# Altium schematic sheet Sheet1.SchDoc: Контроллер нетривиального станка с ЧПУ
size 420 x 297 mm; Date: 22.11.23; Author: Барков; CompanyName: BarCockSemenConductor; DrawnBy: Барков; Engineer: БАРКОВ; Organization: BarCockSemenConductor; DocumentNumber: хххххххх; Revision: 1; SheetNumber: 1; SheetTotal: 5
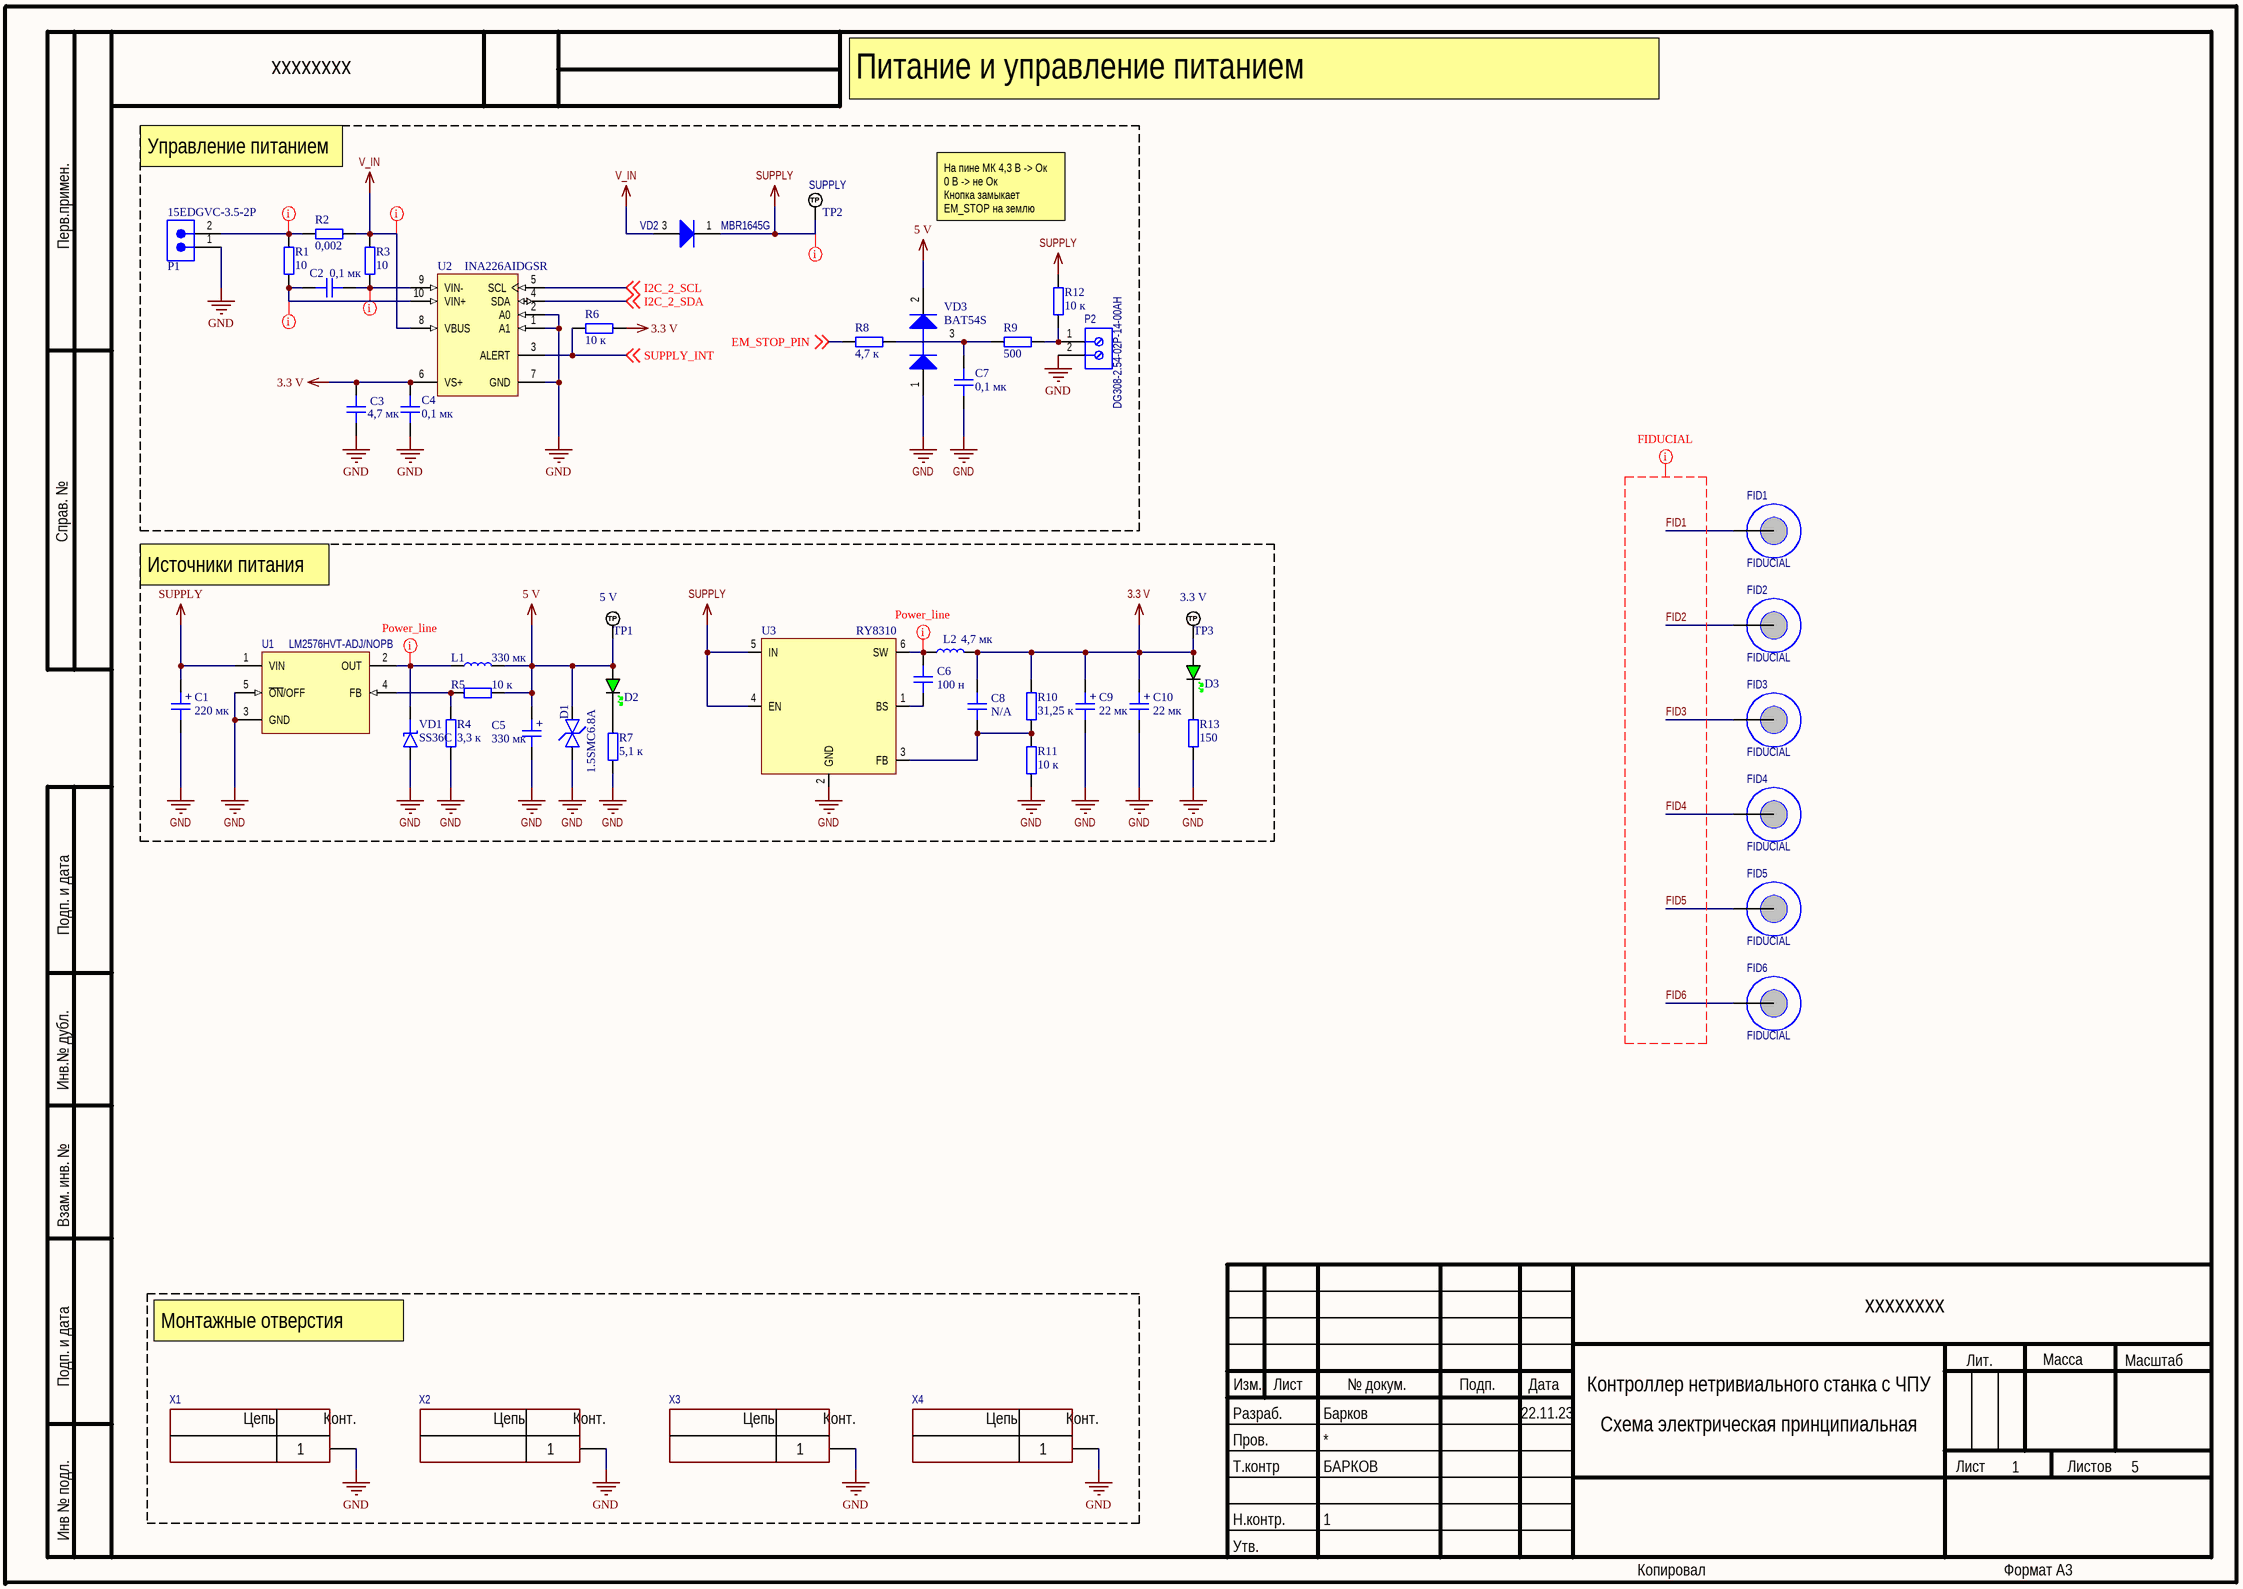
[diagram p0: Sheet1.SchDoc]

## Parts
C1  220 мк  [D10C5H12.5]
C2  0,1 мк  [CAP_0603]
C3  4,7 мк  [CAP_0805]
C4  0,1 мк  [CAP_0603]
C5  330 мк  [D8C3.5H12]
C6  100 н  [CAP_0603]
C7  0,1 мк  [CAP_0603]
C8  N/A  [CAP_0603]
C9  22 мк  [TANTAL_B]
C10  22 мк  [TANTAL_B]
D1  1.5SMC6.8A  [SMC-DO-214AB]
D2  GREEN  [LED_0603_GREEN]  (value not drawn)
D3  GREEN  [LED_0603_GREEN]  (value not drawn)
FID1  FIDUCIAL  [FIDUCIAL]
FID2  FIDUCIAL  [FIDUCIAL]
FID3  FIDUCIAL  [FIDUCIAL]
FID4  FIDUCIAL  [FIDUCIAL]
FID5  FIDUCIAL  [FIDUCIAL]
FID6  FIDUCIAL  [FIDUCIAL]
L1  330 мк  [IND: B82477G4]
L2  4,7 мк  [NRS5020]
P1  15EDGVC-3.5-2P  [691321100002]
P2  DG308-2.54-02P-14-00AH  [PHOE-1725656-2]
R1  10  [RES_0603]
R2  0,002  [ch2512r]
R3  10  [RES_0603]
R4  3,3 к  [RES_0603]
R5  10 к  [RES_0603]
R6  10 к  [RES_0603]
R7  5,1 к  [RES_0603]
R8  4,7 к  [RES_0603]
R9  500  [RES_0603]
R10  31,25 к  [RES_0603]
R11  10 к  [RES_0603]
R12  10 к  [RES_0603]
R13  150  [RES_0603]
TP1  5 V  [PAD_RND_1MM]  (no BOM)
TP2  SUPPLY  [PAD_RND_1MM]  (no BOM)
TP3  3.3 V  [PAD_RND_1MM]  (no BOM)
U1  LM2576HVT-ADJ/NOPB  [KC0005A]
U2  INA226AIDGSR  [DGS0010A_L]
U3  RY8310  [SOT-23-6]
VD1  SS36C  [SMC-DO-214AB]
VD2  MBR1645G  [ONSC-TO-220-2-221B-04_E]
VD3  BAT54S  [ONSC-SOT-323-3-419-04_V]
X1  *  [CON: PADS 1x3mm]  (value not drawn)  (no BOM)
X2  *  [CON: PADS 1x3mm]  (value not drawn)  (no BOM)
X3  *  [CON: PADS 1x3mm]  (value not drawn)  (no BOM)
X4  *  [CON: PADS 1x3mm]  (value not drawn)  (no BOM)

## Nets
3.3 V: C3.2 C4.1 C8.2 C9.1 C10.1 D3.A L2.2 R6.2 R10.1 TP3.1(TP) U2.6(VS+)
5 V: C5.1 D1.K D2.A L1.2 R5.1 TP1.1(TP) VD3.2(K)
GND: C1.2 C3.1 C4.2 C5.2 C7.2 C9.2 C10.2 D1.A P1.1 P2.2 R4.1 R7.1 R11.2 R13.1 U1.3(GND) U1.5(~{ON}/OFF) U2.1(A1) U2.2(A0) U2.7(GND) U3.2(GND) VD1.A VD3.1(A) X1.1 X2.1 X3.1 X4.1
SUPPLY: C1.1 R12.2 TP2.1(TP) U1.1(VIN) U3.4(EN) U3.5(IN) VD2.1(K)
V_IN: R2.2 R3.1 U2.8(VBUS) VD2.3(A)
EM_STOP_PIN: R8.2 ; off-sheet EM_STOP_PIN
FID1: FID1.1
FID2: FID2.1
FID3: FID3.1
FID4: FID4.1
FID5: FID5.1
FID6: FID6.1
I2C_2_SCL: U2.5(SCL) ; off-sheet I2C_2_SCL
I2C_2_SDA: U2.4(SDA) ; off-sheet I2C_2_SDA
SUPPLY_INT: R6.1 U2.3(ALERT) ; off-sheet SUPPLY_INT
NetC2_1: C2.1 R3.2 U2.9(VIN-)
NetC2_2: C2.2 R1.2 U2.10(VIN+)
NetC6_1: C6.1 U3.1(BS)
NetC6_2: C6.2 L2.1 U3.6(SW)
NetC7_1: C7.1 R8.1 R9.2 VD3.3(K/A)
NetC8_1: C8.1 R10.2 R11.1 U3.3(FB)
NetD2_K: D2.K R7.2
NetD3_K: D3.K R13.2
NetL1_1: L1.1 U1.2(OUT) VD1.K
NetP1_2: P1.2 R1.1 R2.1
NetP2_1: P2.1 R9.1 R12.1
NetR4_2: R4.2 R5.2 U1.4(FB)

## Layout directives
net class Power_line: NetC6_2, NetL1_1
net class Low_Power_Line: NetC2_1, NetC2_2, NetP1_2, SUPPLY, V_IN
net class FIDUCIAL: FID1, FID2, FID3, FID4, FID5, FID6

## Notes on the sheet
- Питание и управление питанием
- Управление питанием
- На пине МК 4,3 В -> Ок
  0 В -> не Ок
  Кнопка замыкает EM_STOP на землю
- Источники питания
- Монтажные отверстия
- Перв.примен.
- Справ. №
- Подп. и дата
- Инв.№ дубл.
- Взам. инв. №
- Изм.
- Лист
- № докум.
- Подп.
- Дата
- Лит.
- Масса
- Масштаб
- Пров.
- Т.контр
- Разраб.
- Схема электрическая принципиальная
- 1
- Листов
- Инв № подл.
- Н.контр.
- Утв.
- Копировал
- Формат А3
- (in symbol 1-Connector) Цепь; Конт.
- (in symbol CAP_ALEL_16x16.5_25V) +

## Library data of the parts
C1 = CAP_ALEL_16x16.5_25V: Электролитический конденсатор; Voltage: 50; Type: CAP_ELECTROLYTIC; ChipDip: 9000565903; Model: JRB1H221M05001000120000B; Value: 220 мк; Mount: THT
C2 C4 C7 = CAP_0603: Керамический конденсатор; Type: CAP_CERAMIC; Value: 0,1 мк; ChipDip: *; Mount: SMD
C3 C6 C8 = CAP_0805: Керамический конденсатор; Type: CAP_CERAMIC; Mount: SMD
  C3: Value: 4,7 мк; ChipDip: *
  C6: Value: 100 н
  C8: Value: N/A
C5 = CAP_ALEL_16x16.5_25V: Электролитический конденсатор; Voltage: 16; Type: CAP_ELECTROLYTIC; ChipDip: 9000565907; Model: JRB1C331M03500800120000B; Value: 330 мк; Mount: THT
C9 C10 = CAP_ALEL_16x16.5_25V: Танталовый конденсатор; Voltage: 6,3; Type: CAP_TANTALUM; ChipDip: 9000629219; Value: 22 мк; Model: *; Mount: SMD
D1 = D_TVS_BI_SMC: Защитный диод; ChipDip: 9001169270; Value: 5 В; Type: DIODE; Model: 1.5SMC6.8A; Mount: SMD
D2 D3 = LED_0603_GREEN: Зелёный светодиод; Type: LED; Model: *; ChipDip: *; Value: GREEN; Mount: SMD
FID1-FID6 = FIDUCIAL: Реперная метка; Mount: SMD; Type: FIDUCIAL
L1 = NRS5020: Индуктор; ChipDip: 450851416; Type: INDUCTOR; Model: B82477G4334M; Value: 330 мк; Mount: SMD
L2 = NRS5020: Индуктор; ChipDip: 450851416; Type: INDUCTOR; Value: 4,7 мк; Mount: SMD
P1 = CMP-1502-01783-2: Раъёмный винтовой клеммник; ChipDip: 8025411938; Model: 15EDGVC-3.5-2P; Type: CONNETOR; Mount: THT
P2 = CMP-2000-05299-1: Винтовой клеммник; ChipDip: 63066; Model: DG308-2.54-02P-14-00AH; Type: CONNECTOR; Mount: THT
R1 R3-R9 R12 R13 = RES_0603: Резистор; Type: RESISTOR; ChipDip: *; Mount: SMD
  R1 R3: Value: 10
  R4: Value: 3,3 к
  R5 R6 R12: Value: 10 к
  R7: Value: 5,1 к
  R8: Value: 4,7 к
  R9: Value: 500
  R13: Value: 150
R2 = RES_0603: Резистор; ChipDip: 8001939518; Model: CRE2512-FZ-R002E-3; Value: 0,002; Type: RESISTOR; Mount: SMD
R10 R11 = RES_0805: Резистор; Type: RESISTOR; Mount: SMD
  R10: Value: 31,25 к
  R11: Value: 10 к
TP1-TP3 = TEST_POINT_RND_1MM: Type: *
  TP1: CustomTxt: 5 V
  TP2: CustomTxt: SUPPLY
  TP3: CustomTxt: 3.3 V
U1 = CMP-0069-01994-3: Понижающий DC-DC; ChipDip: 9000135775; ComponentLink1Description: Datasheet URL; ComponentLink1URL: http://www.ti.com/general/docs/lit/getliterature.tsp?genericPartNumber=LM2576HV&fileType=pdf; Type: IC; Model: LM2576HVT-ADJ/NOPB; Mount: THT
U2 = CMP-0704-00058-2: Измеритель мощности; ChipDip: 8026989887; ComponentLink2URL: http://www.ti.com/general/docs/lit/getliterature.tsp?genericPartNumber=INA226&fileType=pdf; ComponentLink1URL: http://www.ti.com/; ComponentLink3Description: Package Specification; ComponentLink2Description: Datasheet; ComponentLink3URL: http://www.ti.com/lit/ml/mpds035b/mpds035b.pdf; ComponentLink1Description: Manufacturer URL; Model: INA226AIDGSR; Type: IC; Mount: SMD
U3 = MT2492: Понижающий DC-DC; ChipDip: 8026700717; Model: RY8310; Type: IC; Mount: SMD
VD1 = D_SCHOTTKY_SMC: Диод; ChipDip: 9000982605; Type: DIODE; Value: SS36C; Mount: SMD
VD2 = CMP-1055-00599-1: Мощный диод; ChipDip: 9000520102; Type: DIODE; ComponentLink3URL: http://www.onsemi.com/pub_link/Collateral/BYW29-D.PDF; ComponentLink1URL: http://www.onsemi.com/; ComponentLink2URL: http://www.onsemi.cn/pub_link/Collateral/MBR1635-D.PDF; ComponentLink3Description: Package Specification; ComponentLink2Description: Datasheet; ComponentLink1Description: Manufacturer URL; Model: MBR1645G; Mount: THT
VD3 = CMP-1055-00559-1: Пара последовательных диодов; ChipDip: 9001106105; Type: DIODE; ComponentLink1URL: http://www.onsemi.com/; ComponentLink1Description: Manufacturer URL; ComponentLink3URL: http://www.onsemi.com/pub_link/Collateral/419-04.PDF; ComponentLink2URL: http://www.onsemi.cn/pub_link/Collateral/BAT54SWT1-D.PDF; ComponentLink3Description: Package Specification; ComponentLink2Description: Datasheet; Model: BAT54S; Mount: SMD
X1-X4 = 1-Connector